# Altium project main_io.PrjPcb (part 6 of 6)

## Sheet limit_switches.SchDoc: Limit Switches
size A4; Organization: Badgerloop; Address1: 133 Engineering Research; Address2: Building; Address3: Madison, WI 53715; SheetNumber: 19
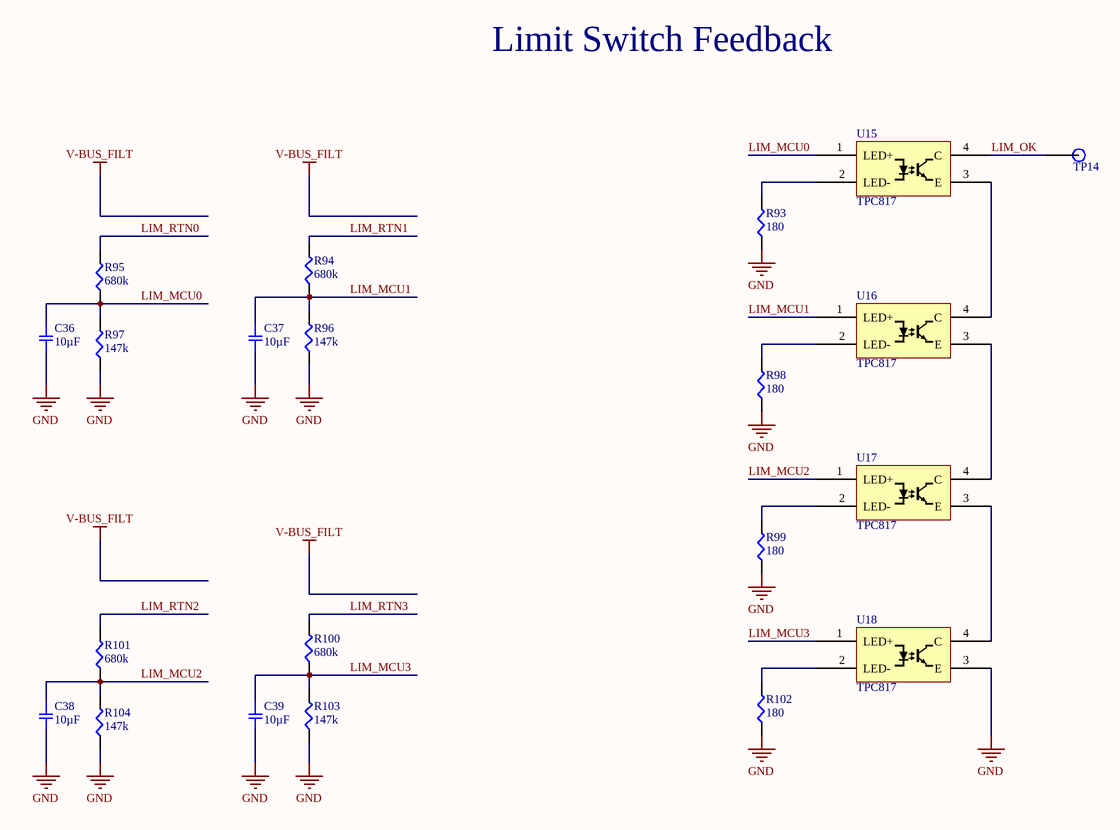
[diagram p18: limit_switches.SchDoc]

### Parts
C36  10µF  [SMD-0805C]
C37  10µF  [SMD-0805C]
C38  10µF  [SMD-0805C]
C39  10µF  [SMD-0805C]
R93  180  [SMD-0805-RES]
R94  680k  [SMD-0805-RES]
R95  680k  [SMD-0805-RES]
R96  147k  [SMD-0805-RES]
R97  147k  [SMD-0805-RES]
R98  180  [SMD-0805-RES]
R99  180  [SMD-0805-RES]
R100  680k  [SMD-0805-RES]
R101  680k  [SMD-0805-RES]
R102  180  [SMD-0805-RES]
R103  147k  [SMD-0805-RES]
R104  147k  [SMD-0805-RES]
TP14  TP  [Test Point]  (value not drawn)
U15  TPC817  [SOT200P1005X328-5N]
U16  TPC817  [SOT200P1005X328-5N]
U17  TPC817  [SOT200P1005X328-5N]
U18  TPC817  [SOT200P1005X328-5N]

### Nets
GND: C36.2 C37.2 C38.2 C39.2 R93.1 R96.1 R97.1 R98.1 R99.1 R102.1 R103.1 R104.1 U18.3(E)
LIM_MCU0: C36.1 R95.1 R97.2 U15.1(LED+)
LIM_MCU1: C37.1 R94.1 R96.2 U16.1(LED+)
LIM_MCU2: C38.1 R101.1 R104.2 U17.1(LED+)
LIM_MCU3: C39.1 R100.1 R103.2 U18.1(LED+)
LIM_OK: TP14.1 U15.4(C)
LIM_RTN0: R95.2
LIM_RTN1: R94.2
LIM_RTN2: R101.2
LIM_RTN3: R100.2
NetR93_2: R93.2 U15.2(LED-)
NetR98_2: R98.2 U16.2(LED-)
NetR99_2: R99.2 U17.2(LED-)
NetR102_2: R102.2 U18.2(LED-)
NetU15_3: U15.3(E) U16.4(C)
NetU16_3: U16.3(E) U17.4(C)
NetU17_3: U17.3(E) U18.4(C)

### Notes on the sheet
- Limit Switch Feedback
- Title
- Size:
- Date:
- A4
- Number:
- Time:
- Revision:
- Sheet
- of
- File:

### Library data of the parts
C36-C39 = GRM21BC81E106KE51L: CAP CER 10UF 25V X6S 0805; Manufacturer: Murata Electronics North America; Factory Stock: 0; Unit Price (USD): 0.25; Minimum Quantity: 1; Tolerance: ±10%; Datasheets: http://www.murata.com/~/media/webrenewal/support/library/catalog/products/capacitor/mlcc/c02e.pdf; Image: //media.digikey.com/Renders/Murata%20Renders/0805%20(2012%20Metric)%20.85mm.jpg; Digi-Key Part Number: 490-10502-1-ND; Part Number: GRM21BC81E106KE51L; Quantity Available: 230; @ qty: 0; Packaging: Cut Tape (CT); Series: GRM; Part Status: Active; Value: 10µF; Voltage: 25V; Temperature Coefficient: X6S; Operating Temperature: -55°C ~ 105°C; Features: Derating Recommended; Ratings: -; Applications: General Purpose; Mounting Type: Surface Mount, MLCC; Package / Case: 0805 (2012 Metric); Size / Dimension: 0.079" L x 0.049" W (2.00mm x 1.25mm); Height - Seated (Max): -; Thickness (Max): 0.055" (1.40mm); Lead Spacing: -; Lead Style: -
R93 R98 R99 R102 = ERJ-6ENF1800V: RES SMD 180 OHM 1% 1/8W 0805; Manufacturer: Panasonic Electronic Components; Factory Stock: 0; Unit Price (USD): 0.00729; @ qty: 1500; Minimum Quantity: 1; Power (Watts): 0.125W, 1/8W; Temperature Coefficient: ±100ppm/°C; Part Number: ERJ-6ENF1800V; Datasheets: http://industrial.panasonic.com/www-cgi/jvcr13pz.cgi?E+PZ+3+AOA0002+ERJ6ENF1800V+7+WW; Image: //media.digikey.com/Renders/Panasonic%20Renders/ERJ-0805%20Pkg.jpg; Digi-Key Part Number: P180CCT-ND; Quantity Available: 33231; Packaging: Cut Tape (CT); Series: ERJ; Part Status: Active; Value: 180; Tolerance: ±1%; Composition: Thick Film; Features: Automotive AEC-Q200; Operating Temperature: -55°C ~ 155°C; Package / Case: 0805 (2012 Metric); Supplier Device Package: 0805; Size / Dimension: 0.079" L x 0.049" W (2.00mm x 1.25mm); Height - Seated (Max): 0.028" (0.70mm); Number of Terminations: 2; Failure Rate: -
R94 R95 R100 R101 = ERJ-6ENF6803V: RES SMD 680K OHM 1% 1/8W 0805; Manufacturer: Panasonic Electronic Components; Factory Stock: 0; Unit Price (USD): 0.00729; @ qty: 1500; Minimum Quantity: 1; Power (Watts): 0.125W, 1/8W; Temperature Coefficient: ±100ppm/°C; Part Number: ERJ-6ENF6803V; Datasheets: http://industrial.panasonic.com/www-cgi/jvcr13pz.cgi?E+PZ+3+AOA0002+ERJ6ENF6803V+7+WW; Image: //media.digikey.com/Renders/Panasonic%20Renders/ERJ-0805%20Pkg.jpg; Digi-Key Part Number: P680KCCT-ND; Quantity Available: 41854; Packaging: Cut Tape (CT); Series: ERJ; Part Status: Active; Value: 680k; Tolerance: ±1%; Composition: Thick Film; Features: Automotive AEC-Q200; Operating Temperature: -55°C ~ 155°C; Package / Case: 0805 (2012 Metric); Supplier Device Package: 0805; Size / Dimension: 0.079" L x 0.049" W (2.00mm x 1.25mm); Height - Seated (Max): 0.028" (0.70mm); Number of Terminations: 2; Failure Rate: -
R96 R97 R103 R104 = ERJ-6ENF1473V: RES SMD 147K OHM 1% 1/8W 0805; Manufacturer: Panasonic Electronic Components; Factory Stock: 0; Unit Price (USD): 0.00729; @ qty: 1500; Minimum Quantity: 1; Power (Watts): 0.125W, 1/8W; Temperature Coefficient: ±100ppm/°C; Part Number: ERJ-6ENF1473V; Datasheets: http://industrial.panasonic.com/www-cgi/jvcr13pz.cgi?E+PZ+3+AOA0002+ERJ6ENF1473V+7+WW; Image: //media.digikey.com/Renders/Panasonic%20Renders/ERJ-0805%20Pkg.jpg; Digi-Key Part Number: P147KCCT-ND; Quantity Available: 10283; Packaging: Cut Tape (CT); Series: ERJ; Part Status: Active; Value: 147k; Tolerance: ±1%; Composition: Thick Film; Features: Automotive AEC-Q200; Operating Temperature: -55°C ~ 155°C; Package / Case: 0805 (2012 Metric); Supplier Device Package: 0805; Size / Dimension: 0.079" L x 0.049" W (2.00mm x 1.25mm); Height - Seated (Max): 0.028" (0.70mm); Number of Terminations: 2; Failure Rate: -
TP14 = TP: SMD TEST POINT
U15-U18 = TPC817: as U32-U34 on sheet shutdown_circuit; Digikey Link: https://www.digikey.com/product-detail/en/taiwan-semiconductor-corporation/TPC817S1B-RAG/TPC817S1BRAGCT-ND/7359679; Digikey P/N: TPC817S1BRAGCT-ND

## Sheet power_28V.SchDoc: 28V Boost
size A4; Engineer: S.Riggleman; Organization: Badgerloop; Address1: 133 Engineering Research; Address2: Building; Address3: Madison, WI 53715; SheetNumber: 20
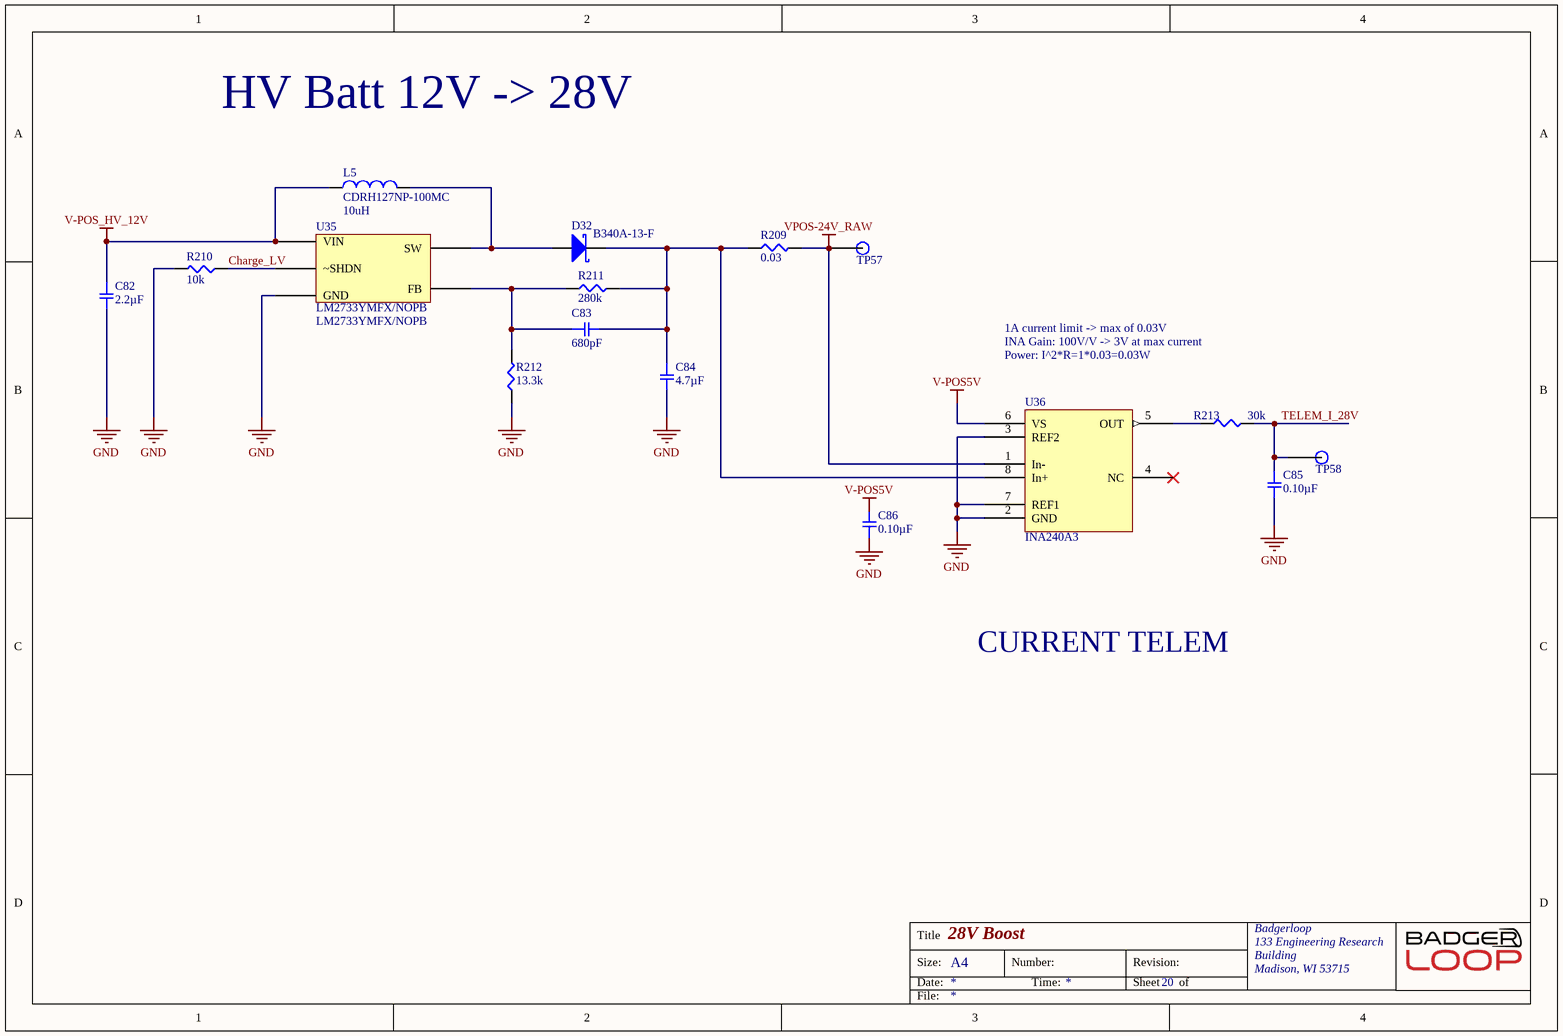
[diagram p19: power_28V.SchDoc]

### Parts
C82  2.2µF  [SMD-1206C]
C83  680pF  [SMD-0805C]
C84  4.7µF  [SMD-1206C]
C85  0.10µF  [SMD-0805C]
C86  0.10µF  [SMD-0805C]
D32  B340A-13-F  [DIOM4326X20N]
L5  CDRH127NP-100MC  Inductance: 10uH  [INDP120120X80N]
R209  0.03  [SMD-1206-RES]
R210  10k  [SMD-0805-RES]
R211  280k  [SMD-0805-RES]
R212  13.3k  [SMD-0805-RES]
R213  30k  [SMD-0805-RES]
TP57  TP  [Test Point]  (value not drawn)
TP58  TP  [Test Point]  (value not drawn)
U35  LM2733YMFX/NOPB  [TSOP95P280X145-6N]
U36  INA240A3  [SOIC127P600X175-8N]

### Nets
GND: C82.2 C84.2 C85.2 C86.1 R210.2 R212.1 U35.2(GND) U36.2(GND) U36.3(REF2) U36.7(REF1)
V-POS5V: C86.2 U36.6(VS)
V-POS_HV_12V: C82.1 L5.1 U35.6(VIN)
VPOS-24V_RAW: R209.2 TP57.1 U36.1(In-)
Charge_LV: R210.1 U35.4(~SHDN)
TELEM_I_28V: C85.1 R213.2 TP58.1
NetC83_1: C83.1 R211.1 R212.2 U35.3(FB)
NetC83_2: C83.2 C84.1 D32.1(K) R209.1 R211.2 U36.8(In+)
NetD32_2: D32.2(A) L5.2 U35.1(SW)
NetR213_1: R213.1 U36.5(OUT)

Not connected (* = marked no-connect by the designer): U36 4(NC)*

### Notes on the sheet
- HV Batt 12V -> 28V
- 1A current limit -> max of 0.03V
- INA Gain: 100V/V -> 3V at max current
- Power: I^2*R=1*0.03=0.03W
- CURRENT TELEM
- Title
- Size:
- Date:
- A4
- Number:
- Time:
- Revision:
- Sheet
- of
- File:

### Library data of the parts
C82 = GRT31CC81H225KE01L: CAP CER 2.2UF 50V X6S 1206; Manufacturer: Murata Electronics North America; Factory Stock: 0; Unit Price (USD): 0.33; Minimum Quantity: 1; Tolerance: ±10%; Datasheets: http://search.murata.co.jp/Ceramy/image/img/A01X/G101/ENG/GRT31CC81H225KE01-01.pdf; Image: //media.digikey.com/Renders/Murata%20Renders/GR331BD72E473KW01L.jpg; Digi-Key Part Number: 490-12422-1-ND; Part Number: GRT31CC81H225KE01L; Quantity Available: 2977; @ qty: 0; Packaging: Cut Tape (CT); Series: GRT; Part Status: Active; Value: 2.2µF; Voltage: 50V; Temperature Coefficient: X6S; Operating Temperature: -55°C ~ 105°C; Features: -; Ratings: AEC-Q200; Applications: Automotive; Mounting Type: Surface Mount, MLCC; Package / Case: 1206 (3216 Metric); Size / Dimension: 0.126" L x 0.063" W (3.20mm x 1.60mm); Height - Seated (Max): -; Thickness (Max): 0.071" (1.80mm); Lead Spacing: -; Lead Style: -
C83 = GRM2195C2A681JA01D: CAP CER 680PF 100V NP0 0805; Manufacturer: Murata Electronics North America; Factory Stock: 0; Unit Price (USD): 0.22; Minimum Quantity: 1; Tolerance: ±5%; Temperature Coefficient: C0G, NP0; Datasheets: http://www.murata.com/~/media/webrenewal/support/library/catalog/products/capacitor/mlcc/c02e.pdf; Image: //media.digikey.com/Renders/Murata%20Renders/0805%20(2012%20Metric)%20.85mm.jpg; Digi-Key Part Number: 490-1613-1-ND; Part Number: GRM2195C2A681JA01D; Quantity Available: 4255; @ qty: 0; Packaging: Cut Tape (CT); Series: GRM; Part Status: Active; Value: 680pF; Voltage: 100V; Operating Temperature: -55°C ~ 125°C; Features: -; Ratings: -; Applications: General Purpose; Mounting Type: Surface Mount, MLCC; Package / Case: 0805 (2012 Metric); Size / Dimension: 0.079" L x 0.049" W (2.00mm x 1.25mm); Height - Seated (Max): -; Thickness (Max): 0.037" (0.95mm); Lead Spacing: -; Lead Style: -
C84 = GRM31CR71H475KA12L: CAP CER 4.7UF 50V X7R 1206; Manufacturer: Murata Electronics North America; Factory Stock: 0; Unit Price (USD): 0.32; Minimum Quantity: 1; Tolerance: ±10%; Datasheets: http://www.murata.com/~/media/webrenewal/support/library/catalog/products/capacitor/mlcc/c02e.pdf; Image: //media.digikey.com/Renders/Murata%20Renders/GR331BD72E473KW01L.jpg; Digi-Key Part Number: 490-6521-1-ND; Part Number: GRM31CR71H475KA12L; Quantity Available: 248000; @ qty: 0; Packaging: Cut Tape (CT); Series: GRM; Part Status: Active; Value: 4.7µF; Voltage: 50V; Temperature Coefficient: X7R; Operating Temperature: -55°C ~ 125°C; Features: -; Ratings: -; Applications: General Purpose; Mounting Type: Surface Mount, MLCC; Package / Case: 1206 (3216 Metric); Size / Dimension: 0.126" L x 0.063" W (3.20mm x 1.60mm); Height - Seated (Max): -; Thickness (Max): 0.071" (1.80mm); Lead Spacing: -; Lead Style: -
C85 = GRM219R71C104KA01D: as C40-C42 on sheet misc_sensors; Datasheets: http://www.murata.com/~/media/webrenewal/support/library/catalog/products/capacitor/mlcc/c02e.pdf; Image: //media.digikey.com/Renders/Murata%20Renders/0805%20(2012%20Metric)%20.85mm.jpg; Digi-Key Part Number: 490-1683-1-ND; Part Number: GRM219R71C104KA01D; Quantity Available: 265464; @ qty: 0; Packaging: Cut Tape (CT); Series: GRM; Part Status: Active; Value: 0.10µF; Voltage: 16V; Temperature Coefficient: X7R; Operating Temperature: -55°C ~ 125°C; Features: -; Ratings: -; Applications: General Purpose; Mounting Type: Surface Mount, MLCC; Package / Case: 0805 (2012 Metric); Size / Dimension: 0.079" L x 0.049" W (2.00mm x 1.25mm); Height - Seated (Max): -; Thickness (Max): 0.037" (0.95mm); Lead Spacing: -; Lead Style: -
C86 = GRM21B7U1A104JA01L: CAP CER 0.1UF 10V U2J 0805; Manufacturer: Murata Electronics North America; Factory Stock: 0; Unit Price (USD): 0.4; Minimum Quantity: 1; Tolerance: ±5%; Datasheets: http://www.murata.com/~/media/webrenewal/support/library/catalog/products/capacitor/mlcc/c02e.pdf; Image: //media.digikey.com/Renders/Murata%20Renders/0805%20(2012%20Metric)%20.85mm.jpg; Digi-Key Part Number: 490-11592-1-ND; Part Number: GRM21B7U1A104JA01L; Quantity Available: 3390; @ qty: 0; Packaging: Cut Tape (CT); Series: GRM; Part Status: Active; Value: 0.10µF; Voltage: 10V; Temperature Coefficient: U2J; Operating Temperature: -55°C ~ 125°C; Features: -; Ratings: -; Applications: General Purpose; Mounting Type: Surface Mount, MLCC; Package / Case: 0805 (2012 Metric); Size / Dimension: 0.079" L x 0.049" W (2.00mm x 1.25mm); Height - Seated (Max): -; Thickness (Max): 0.053" (1.35mm); Lead Spacing: -; Lead Style: -
D32 = B340A-13-F: DIODE SCHOTTKY 40V 3A SMA; Manufacturer: Diodes; Element Configuration: Single; Peak Reverse Current: 500uA; Forward Voltage: 500mV; Max Forward Surge Current (Ifsm): 80A; Polarity: Standard; Capacitance: 250pF; Supplier 1: Digi-Key; Stock 1: 438328; Pricing 1: 1=0.42000, 10=0.33900, 100=0.23070, 500=0.17304, 1000=0.12978 (USD); RoHS: Yes; Mount: Surface Mount; Case/Package: SMA; Number of Pins: 2; Weight: 0.002258oz; Contact Plating: Tin,Matte; Min Operating Temperature: -55°C; Max Operating Temperature: 125°C; Forward Current: 3A; Max Repetitive Reverse Voltage (Vrrm): 40V; Packaging: Tape and Reel; Peak Non-Repetitive Surge Current: 80A; Package Quantity: 5000; Average Rectified Current: 3A; Termination: SMD/SMT; Voltage Rating (DC): 40V; Current Rating: 3A; Output Current: 3A; Current: 3A; Voltage: 40V; Max Reverse Voltage (DC): 40V; Length: 4.6mm; Height: 2.3mm; Width: 2.92mm; Radiation Hardening: No; REACH SVHC: No SVHC; Lead Free: Lead Free; ComponentLink1URL: https://datasheet.ciiva.com/26949/getdatasheetpartid-143394-26949352.pdf?src-supplier=Verical; ComponentLink1Description: https://datasheet.ciiva.com/26949/getdatasheetpartid-143394-26949352.pdf?src-supplier=Verical; ComponentLink2URL: https://datasheet.ciiva.com/4245/861ds30891-4245763.pdf?src-supplier=Arrow; ComponentLink2Description: https://datasheet.ciiva.com/4245/861ds30891-4245763.pdf?src-supplier=Arrow; ComponentLink3URL: https://datasheet.ciiva.com/1177/ds30891-1177476.pdf?src-supplier=Element14; ComponentLink3Description: https://datasheet.ciiva.com/1177/ds30891-1177476.pdf?src-supplier=Element14; ComponentLink4URL: https://datasheet.ciiva.com/913/ds30891-913638.pdf?src-supplier=Digi-Key; ComponentLink4Description: https://datasheet.ciiva.com/913/ds30891-913638.pdf?src-supplier=Digi-Key; ComponentLink5URL: https://datasheet.ciiva.com/46393/1911813-46393773.pdf?src-supplier=Element14; ComponentLink5Description: https://datasheet.ciiva.com/46393/1911813-46393773.pdf?src-supplier=Element14; ComponentLink6URL: https://datasheet.ciiva.com/1240/ds30891-1240228.pdf?src-supplier=Newark; ComponentLink6Description: https://datasheet.ciiva.com/1240/ds30891-1240228.pdf?src-supplier=Newark; ComponentLink7URL: https://datasheet.ciiva.com/913/ds30891-913637.pdf?src-supplier=Digi-Key; ComponentLink7Description: https://datasheet.ciiva.com/913/ds30891-913637.pdf?src-supplier=Digi-Key; ComponentLink8URL: https://datasheet.ciiva.com/913/ds30891-913639.pdf?src-supplier=Digi-Key; ComponentLink8Description: https://datasheet.ciiva.com/913/ds30891-913639.pdf?src-supplier=Digi-Key; Supplier Part Number 1: B340A-FDICT-ND
L5 = CDRH127NP-100MC: Fixed Inductors 10uH 5.4A; Manufacturer: Sumida; Core Material: Ferrite; Tolerance: 20%; Shielding: Shielded; DC Resistance (DCR): 21.6mR; Test Frequency: 1kHz; Supplier 1: Digi-Key; Stock 1: 1624; Pricing 1: 1=2.02, 10=1.863, 100=1.3041 (USD); Mount: Surface Mount; Case/Package: Nonstandard; Min Operating Temperature: -40°C; Max Operating Temperature: 100°C; Package Quantity: 1; Current Rating: 5.4A; Packaging: Tape and Reel; Max DC Current: 5.4A; Termination: SMD/SMT; DC Current: 5.4A; Military Standard: Not; Length: 12.3mm; Height: 8mm; Width: 0.472inch; Height - Seated (Max): 0.315inch; Depth: 12.3mm; Radiation Hardening: No; Lead Free: Lead Free; ComponentLink1URL: http://datasheet.iiic.cc/sumida/CDRH127NP-100MC.pdf?src-supplier=IIIC; ComponentLink1Description: http://datasheet.iiic.cc/sumida/CDRH127NP-100MC.pdf?src-supplier=IIIC; Supplier Part Number 1: 308-1457-6-ND
R209 = ERJ-8CWFR030V: RES SMD 0.03 OHM 1% 1W 1206; Manufacturer: Panasonic Electronic Components; Factory Stock: 0; Unit Price (USD): 0.12302; @ qty: 1500; Minimum Quantity: 1; Temperature Coefficient: ±75ppm/°C; Part Number: ERJ-8CWFR030V; Datasheets: https://industrial.panasonic.com/cdbs/www-data/pdf/RDA0000/AOA0000C239.pdf; Image: //media.digikey.com/Renders/Panasonic%20Renders/ERJ-1206%20Pkg.jpg; Digi-Key Part Number: P0.03BVCT-ND; Quantity Available: 14446; Packaging: Cut Tape (CT); Series: ERJ; Part Status: Active; Value: 0.03; Tolerance: ±1%; Power (Watts): 1W; Composition: Thick Film; Features: Automotive AEC-Q200, Current Sense; Operating Temperature: -55°C ~ 155°C; Package / Case: 1206 (3216 Metric); Supplier Device Package: 1206; Size / Dimension: 0.126" L x 0.063" W (3.20mm x 1.60mm); Height - Seated (Max): 0.030" (0.75mm); Number of Terminations: 2; Failure Rate: -
R210 = ERJ-P06J103V: as R1-R5 on sheet adc; Part Number: ERJ-P06J103V; Datasheets: https://industrial.panasonic.com/cdbs/www-data/pdf/RDA0000/AOA0000C243.pdf; Image: //media.digikey.com/Renders/Panasonic%20Renders/ERJ-0805%20Pkg.jpg; Digi-Key Part Number: P10KADCT-ND; Quantity Available: 413576; Packaging: Cut Tape (CT); Series: ERJ; Part Status: Active; Value: 10k; Tolerance: ±5%; Composition: Thick Film; Features: Automotive AEC-Q200, Pulse Withstanding; Operating Temperature: -55°C ~ 155°C; Package / Case: 0805 (2012 Metric); Supplier Device Package: 0805; Size / Dimension: 0.079" L x 0.049" W (2.00mm x 1.25mm); Height - Seated (Max): 0.028" (0.70mm); Number of Terminations: 2; Failure Rate: -
R211 = ERJ-6ENF2803V: RES SMD 280K OHM 1% 1/8W 0805; Manufacturer: Panasonic Electronic Components; Factory Stock: 0; Unit Price (USD): 0.00729; @ qty: 1500; Minimum Quantity: 1; Power (Watts): 0.125W, 1/8W; Temperature Coefficient: ±100ppm/°C; Part Number: ERJ-6ENF2803V; Datasheets: http://industrial.panasonic.com/www-cgi/jvcr13pz.cgi?E+PZ+3+AOA0002+ERJ6ENF2803V+7+WW; Image: //media.digikey.com/Renders/Panasonic%20Renders/ERJ-0805%20Pkg.jpg; Digi-Key Part Number: P280KCCT-ND; Quantity Available: 59228; Packaging: Cut Tape (CT); Series: ERJ; Part Status: Active; Value: 280k; Tolerance: ±1%; Composition: Thick Film; Features: Automotive AEC-Q200; Operating Temperature: -55°C ~ 155°C; Package / Case: 0805 (2012 Metric); Supplier Device Package: 0805; Size / Dimension: 0.079" L x 0.049" W (2.00mm x 1.25mm); Height - Seated (Max): 0.028" (0.70mm); Number of Terminations: 2; Failure Rate: -
R212 = ERJ-6ENF1332V: RES SMD 13.3K OHM 1% 1/8W 0805; Manufacturer: Panasonic Electronic Components; Factory Stock: 0; Unit Price (USD): 0.00729; @ qty: 1500; Minimum Quantity: 1; Power (Watts): 0.125W, 1/8W; Temperature Coefficient: ±100ppm/°C; Part Number: ERJ-6ENF1332V; Datasheets: http://industrial.panasonic.com/www-cgi/jvcr13pz.cgi?E+PZ+3+AOA0002+ERJ6ENF1332V+7+WW; Image: //media.digikey.com/Renders/Panasonic%20Renders/ERJ-0805%20Pkg.jpg; Digi-Key Part Number: P13.3KCCT-ND; Quantity Available: 24077; Packaging: Cut Tape (CT); Series: ERJ; Part Status: Active; Value: 13.3k; Tolerance: ±1%; Composition: Thick Film; Features: Automotive AEC-Q200; Operating Temperature: -55°C ~ 155°C; Package / Case: 0805 (2012 Metric); Supplier Device Package: 0805; Size / Dimension: 0.079" L x 0.049" W (2.00mm x 1.25mm); Height - Seated (Max): 0.028" (0.70mm); Number of Terminations: 2; Failure Rate: -
R213 = ERJ-6ENF3002V: as R110-R112 on sheet misc_sensors; Part Number: ERJ-6ENF3002V; Datasheets: http://industrial.panasonic.com/www-cgi/jvcr13pz.cgi?E+PZ+3+AOA0002+ERJ6ENF3002V+7+WW; Image: //media.digikey.com/Renders/Panasonic%20Renders/ERJ-0805%20Pkg.jpg; Digi-Key Part Number: P30.0KCCT-ND; Quantity Available: 88046; Packaging: Cut Tape (CT); Series: ERJ; Part Status: Active; Value: 30k; Tolerance: ±1%; Composition: Thick Film; Features: Automotive AEC-Q200; Operating Temperature: -55°C ~ 155°C; Package / Case: 0805 (2012 Metric); Supplier Device Package: 0805; Size / Dimension: 0.079" L x 0.049" W (2.00mm x 1.25mm); Height - Seated (Max): 0.028" (0.70mm); Number of Terminations: 2; Failure Rate: -
TP57 TP58 = TP: SMD TEST POINT
U35 = LM2733YMFX/NOPB: Conv DC-DC Single Step Up 2.7V to 14V 5-Pin SOT-23 T/R; Manufacturer: TI National Semiconductor; Switching Frequency: 600kHz; Output Current: 1.5A; Number of Outputs: 1; Output Voltage: 40V; Synchronous Rectifier: No; Quiescent Current: 1.1mA; Topology: Boost; Operating Supply Voltage: 14.5V; Output Type: Adjustable; Supplier 1: Digi-Key; Stock 1: 620; Pricing 1: 1=1.86, 10=1.667, 25=1.5724, 100=1.258, 250=1.10076, 500=1.0693, 1000=0.84915 (USD); Mount: Surface Mount; Case/Package: SOT-23; Number of Pins: 5; Contact Plating: Tin,Matte; Min Operating Temperature: -40°C; Max Operating Temperature: 125°C; Package Quantity: 3000; Max Input Voltage: 14V; Min Input Voltage: 2.7V; Packaging: Tape and Reel; Radiation Hardening: No; Lead Free: Lead Free; ComponentLink1URL: http://components.arrow.com/part/dataview/1762_06702878?src-supplier=Arrow+Europe; ComponentLink1Description: http://components.arrow.com/part/dataview/1762_06702878?src-supplier=Arrow+Europe; ComponentLink2URL: http://components.arrow.com/part/dataview/53670479S7334342N1317?src-supplier=Arrow; ComponentLink2Description: http://components.arrow.com/part/dataview/53670479S7334342N1317?src-supplier=Arrow; ComponentLink3URL: http://www.ti.com/lit/ds/symlink/lm2733.pdf?src-supplier=Digi-Key; ComponentLink3Description: http://www.ti.com/lit/ds/symlink/lm2733.pdf?src-supplier=Digi-Key; Supplier Part Number 1: 296-35167-6-ND; Manufacturer Part Number: LM2733YMFX/NOPB
U36 = INA240A3: IC AMP CURRENT SENSE 8-TSSOP 100V/V; Manufacturer: Texas Instruments; Number of Circuits: 1; Slew Rate: 2V/µs; -3db Bandwidth: 400kHz; Input Bias Current: 90uA; Input Offset Voltage (Vos): 5uV; Operating Supply Current: 1.8mA; Supplier 1: Digi-Key; Stock 1: 4680; Pricing 1: 1=2.65, 10=2.377, 25=2.2428, 100=1.7943, 250=1.56996, 500=1.52512, 1000=1.21113 (USD); Mount: Surface Mount; Case/Package: TSSOP; Number of Pins: 8; Min Operating Temperature: -40°C; Max Operating Temperature: 125°C; Packaging: Tape and Reel; ComponentLink1URL: http://www.ti.com/general/docs/lit/getliterature.tsp?genericPartNumber=INA240&fileType=pdf&src-supplier=Farnell; ComponentLink1Description: http://www.ti.com/general/docs/lit/getliterature.tsp?genericPartNumber=INA240&fileType=pdf&src-supplier=Farnell; ComponentLink2URL: http://www.ti.com/lit/ds/symlink/ina240.pdf?src-supplier=Digi-Key; ComponentLink2Description: http://www.ti.com/lit/ds/symlink/ina240.pdf?src-supplier=Digi-Key; Supplier Part Number 1: 296-45090-1-ND

## Nets that join several sheets
GND: connectors (37 pins), beaglebone (12 pins), bus_filter (9 pins), power_5V (23 pins), power_12V (23 pins), can_uart (21 pins), retros (11 pins), arduino_shield (6 pins), bms_interface (6 pins), motor_controller_interface (8 pins), RTC (13 pins), shutdown_circuit (22 pins), adc (20 pins), battery_interface (10 pins), misc_sensors (29 pins), batt_protection (9 pins), gpio (12 pins), limit_switches (13 pins), power_28V (10 pins)
MSTR_SW +: connectors (19 pins), bus_filter (R58.2 R61.1 TP10.1 U9.1), power_5V (6 pins), power_12V (C66.1 C67.1 C68.1 U24.2), retros (R164.1 R167.1 R174.1 R177.1), arduino_shield (P1.2 P3.2), bms_interface (7 pins), motor_controller_interface (D21.2 F14.2 K7.1), shutdown_circuit (10 pins), battery_interface (8 pins)
V-BUS_PROT: bus_filter (L2.1 R57.1 TP8.1), batt_protection (F1.2 F2.2 R27.2 TP3.1)
V-POS3.3V: connectors (P31.1), beaglebone (8 pins), can_uart (6 pins), retros (12 pins), RTC (C78.2 C79.1 U31.2), misc_sensors (C48.1 U19.2), gpio (R69.2 R81.2)
V-POS5V: connectors (P32.1), beaglebone (5 pins), bus_filter (C19.2 U9.6), power_5V (9 pins), power_12V (C73.2 U25.6), can_uart (C28.2 U11.3), arduino_shield (P2.1 P55.5), motor_controller_interface (P47.2), RTC (R180.2 R181.2), shutdown_circuit (S2.1), adc (24 pins), misc_sensors (9 pins), gpio (10 pins), power_28V (C86.2 U36.6)
V-POS12V: connectors (P33.1), power_12V (5 pins), arduino_shield (P4.1 P5.2), bms_interface (F12.1), motor_controller_interface (F13.2), misc_sensors (R109.2 R121.2 R129.2)
V-POS_HV_12V: motor_controller_interface (P46.2), power_28V (C82.1 L5.1 U35.6)
VPOS-24V_RAW: battery_interface (P8.1), batt_protection (10 pins), power_28V (R209.2 TP57.1 U36.1)
32kHz: RTC (R180.1 U31.1), gpio (U14.7)
ADC_EXTRA0: adc (U4.12), misc_sensors (C43.1 R114.2 TP22.1)
ADC_EXTRA1: adc (U4.11), misc_sensors (C47.1 R125.2 TP30.1)
ADC_EXTRA2: adc (U4.10), misc_sensors (C49.1 R134.2 TP32.1)
ANLG_EXC_0: connectors (P37.2), misc_sensors (R108.1 R109.1 TP21.1)
ANLG_EXC_1: connectors (P37.3), misc_sensors (R120.1 R121.1 TP29.1)
ANLG_EXC_2: connectors (P37.4), misc_sensors (R128.1 R129.1 TP31.1)
ANLG_RTN_0: connectors (P37.6), misc_sensors (D15.1 R113.2)
ANLG_RTN_1: connectors (P37.7), misc_sensors (D19.1 R124.2)
ANLG_RTN_2: connectors (P37.8), misc_sensors (D20.1 R132.2)
BATT0_DISABLE: battery_interface (Q4.1 R36.2), gpio (U14.23)
BATT1_DISABLE: battery_interface (Q3.1 R35.2), gpio (U14.24)
BATT2_DISABLE: battery_interface (Q5.1 R37.2), gpio (U14.22)
BATT3_DISABLE: battery_interface (Q6.1 R38.2), gpio (U14.21)
BMS_MPI1: bms_interface (P18.10), gpio (U13.27)
BMS_MPO1: bms_interface (LED3.2 P17.1 P18.2 P19.1), shutdown_circuit (K10.5)
BMS_STAT_FDBK: shutdown_circuit (R189.2 R190.1), gpio (U13.5)
BRK0_PWR_HRN: connectors (P27.1), gpio (U14.27)
BRK0_UART_HRN: connectors (P28.8), gpio (U14.28)
BRK1_PWR_HRN: connectors (P29.1), gpio (U14.1)
BRK1_UART_HRN: connectors (P30.8), gpio (U14.2)
CAN1_H: can_uart (P26.1 R65.1 U11.7), bms_interface (P21.1 R52.1), motor_controller_interface (R136.1)
CAN1_L: can_uart (P25.1 R66.1 U11.6), bms_interface (P21.3 R54.1), motor_controller_interface (R137.1)
CAN1_RXD: beaglebone (U7.24), can_uart (P23.1 U11.4)
CAN1_TERM_H: can_uart (P22.1 R65.2), bms_interface (S1.4)
CAN1_TERM_L: can_uart (C22.2 P22.2 R66.2), bms_interface (S1.5)
CAN1_TXD: beaglebone (U7.26), can_uart (P24.1 U11.1)
Charge_LV: gpio (U13.22), power_28V (R210.1 U35.4)
E-STOP +: connectors (P39.2 P40.1), shutdown_circuit (P48.2 P49.1 R191.1 R194.1)
E-STOP -: connectors (P39.1), shutdown_circuit (5 pins)
E_STOP_FDBK: shutdown_circuit (R196.2 R197.1), gpio (U13.3)
GPIO0_RST_n: beaglebone (U7.108), gpio (R69.1 R77.2 U13.18)
GPIO1_RST_n: beaglebone (U7.110), gpio (R81.1 R89.2 U14.18)
HB_OUT: connectors (D11.1 P28.4 P30.4), beaglebone (U8.1)
High_Contactor_Aux: connectors (P56.4), gpio (U14.26)
HV_CHRG/DCHRG_EN: bms_interface (P18.12 P18.13), shutdown_circuit (K9.5)
I2C1_SCL: beaglebone (P15.2 R43.1), retros (R168.1), RTC (R179.1), adc (R9.2 R20.2), misc_sensors (R127.1), gpio (R74.2 R86.2)
I2C1_SDA: beaglebone (P15.1 R44.2), retros (R169.1), RTC (R182.1), adc (R8.2 R19.2), misc_sensors (R130.1), gpio (R73.2 R85.2)
I2C2_SCL: beaglebone (P16.2 R45.1), retros (R171.1), RTC (R183.1), adc (R7.2 R18.2), misc_sensors (R133.1), gpio (R75.2 R87.2)
I2C2_SDA: beaglebone (P16.1 R46.2), retros (R172.1), RTC (R184.1), adc (R6.2 R17.2), misc_sensors (R131.1), gpio (R76.2 R88.2)
IMD_STAT_FDBK: shutdown_circuit (R201.2 R202.1), gpio (U13.6)
Inertia_Switch +: connectors (P39.4), shutdown_circuit (5 pins)
Inertia_Switch -: connectors (P39.3), shutdown_circuit (5 pins)
INRT_STAT_FDBK: shutdown_circuit (R203.2 R204.1), gpio (U13.7)
INT_SQW: RTC (R181.1 U31.3), gpio (U14.8)
LIM_MCU0: gpio (U13.23), limit_switches (C36.1 R95.1 R97.2 U15.1)
LIM_MCU1: gpio (U13.24), limit_switches (C37.1 R94.1 R96.2 U16.1)
LIM_MCU2: gpio (U13.25), limit_switches (C38.1 R101.1 R104.2 U17.1)
LIM_MCU3: gpio (U13.26), limit_switches (C39.1 R100.1 R103.2 U18.1)
LIM_OK: shutdown_circuit (D28.1 K8.8), limit_switches (TP14.1 U15.4)
LIM_RTN0: connectors (P43.4), limit_switches (R95.2)
LIM_RTN1: connectors (P43.3), limit_switches (R94.2)
LIM_RTN2: connectors (P43.2), limit_switches (R101.2)
LIM_RTN3: connectors (P43.1), limit_switches (R100.2)
LMT_SW_FDBK: shutdown_circuit (R187.2 R188.1), gpio (U13.4)
Low_Contactor_Aux: connectors (P56.3), gpio (U14.25)
Low_Contactor_DRV: connectors (P56.7), bms_interface (P21.2), shutdown_circuit (7 pins)
MCU_HV_EN: shutdown_circuit (U34.1), gpio (U13.28)
MCU_Latch: shutdown_circuit (S2.2 U32.1 U33.1), gpio (U13.1)
MCU_PUMP_PWR: motor_controller_interface (P47.1 U20.1), gpio (U14.3)
MCU_STAT_FDBK: shutdown_circuit (R205.2 R206.1), gpio (U13.8)
MSTR_SW_FDBK: shutdown_circuit (R194.2 R195.1), gpio (U13.2)
PRECHG_HRN: connectors (R67.1 R68.2), gpio (U14.5)
RETRO_0_MCU: beaglebone (U7.112), retros (R162.1 R163.1 TP45.1 U26.4), arduino_shield (P55.4)
RETRO_0_SIG: connectors (P36.7), retros (D24.1 TP46.1 U26.2)
RETRO_1_MCU: beaglebone (U7.114), retros (R165.1 R166.1 TP47.1 U27.4), arduino_shield (P55.3)
RETRO_1_SIG: connectors (P36.6), retros (D25.1 TP49.1 U27.2)
RETRO_2_MCU: beaglebone (U7.116), retros (R170.1 R173.1 TP51.1 U29.4), arduino_shield (P55.2)
RETRO_2_SIG: connectors (P36.5), retros (D26.1 TP52.1 U29.2)
RETRO_WHEEL_MCU: beaglebone (U7.30), retros (R178.2 TP53.1 U28.3)
RETRO_WHEEL_SIG: connectors (P38.3), retros (D27.1 TP54.1 U30.2)
RMS_Contactor_SIG: connectors (P56.5), motor_controller_interface (P44.6)
RMS_Precharge_SIG: connectors (P56.6), motor_controller_interface (P44.2)
RTC_RST_n: RTC (U31.4), gpio (U14.6)
TELEM_I_5V: power_5V (C61.1 R144.2 TP38.1), adc (U2.14)
TELEM_I_12V: power_12V (C72.1 R156.2 TP43.1), adc (U2.13)
TELEM_I_24V: bus_filter (C18.1 R59.2 TP11.1), adc (U2.15)
TELEM_I_28V: adc (U4.9), power_28V (C85.1 R213.2 TP58.1)
TELEM_THERM_0: adc (U4.16), misc_sensors (C41.1 R111.2 TP19.1)
TELEM_THERM_1: adc (U4.15), misc_sensors (C42.1 R112.2 TP20.1)
TELEM_THERM_2: adc (U2.9), misc_sensors (C40.1 R110.2 TP18.1)
TELEM_THERM_3: adc (U2.10), misc_sensors (C46.1 R123.2 TP28.1)
TELEM_THERM_4: adc (U4.14), misc_sensors (C45.1 R122.2 TP27.1)
TELEM_THERM_5: adc (U4.13), misc_sensors (C44.1 R119.2 TP26.1)
TELEM_V_5V: power_5V (C64.1 R147.2), adc (U2.11)
TELEM_V_12V: power_12V (C74.1 R159.2), adc (U2.12)
TELEM_V_24V: bus_filter (C20.1 R62.2 TP12.1), adc (U2.16)
THERM_OUT_0: connectors (P35.4), misc_sensors (5 pins)
THERM_OUT_1: connectors (P35.3), misc_sensors (5 pins)
THERM_OUT_2: connectors (P41.4), misc_sensors (5 pins)
THERM_OUT_3: connectors (P41.3), misc_sensors (5 pins)
THERM_OUT_4: connectors (P42.4), misc_sensors (5 pins)
THERM_OUT_5: connectors (P42.3), misc_sensors (5 pins)
UART4_RXD: beaglebone (P13.2 U7.11), can_uart (U12.12)
UART4_TXD: beaglebone (P13.1 U7.13), can_uart (U12.11)
UART5_RXD: beaglebone (P14.2 U7.138), can_uart (U10.12)
UART5_TXD: beaglebone (P14.1 U7.137), can_uart (U10.11)
UART_RXD_RS232_0: connectors (P28.2), can_uart (D8.2 U10.13)
UART_RXD_RS232_1: connectors (P30.2), can_uart (D10.2 U12.13)
UART_TXD_RS232_0: connectors (P28.3), can_uart (D7.2 U10.14)
UART_TXD_RS232_1: connectors (P30.3), can_uart (D9.2 U12.14)

## Assembly variants
MainIO-DNP: not fitted R1 R2 R3 R4 R6 R7 R11 R12 R13 R14 R15 R16 R19 R20 R52 R54 R70 R71 R73 R74 R77 R80 R82 R83 R84 R85 R86 R89 R109 R121 R127 R129 R130 R140 R179 R182